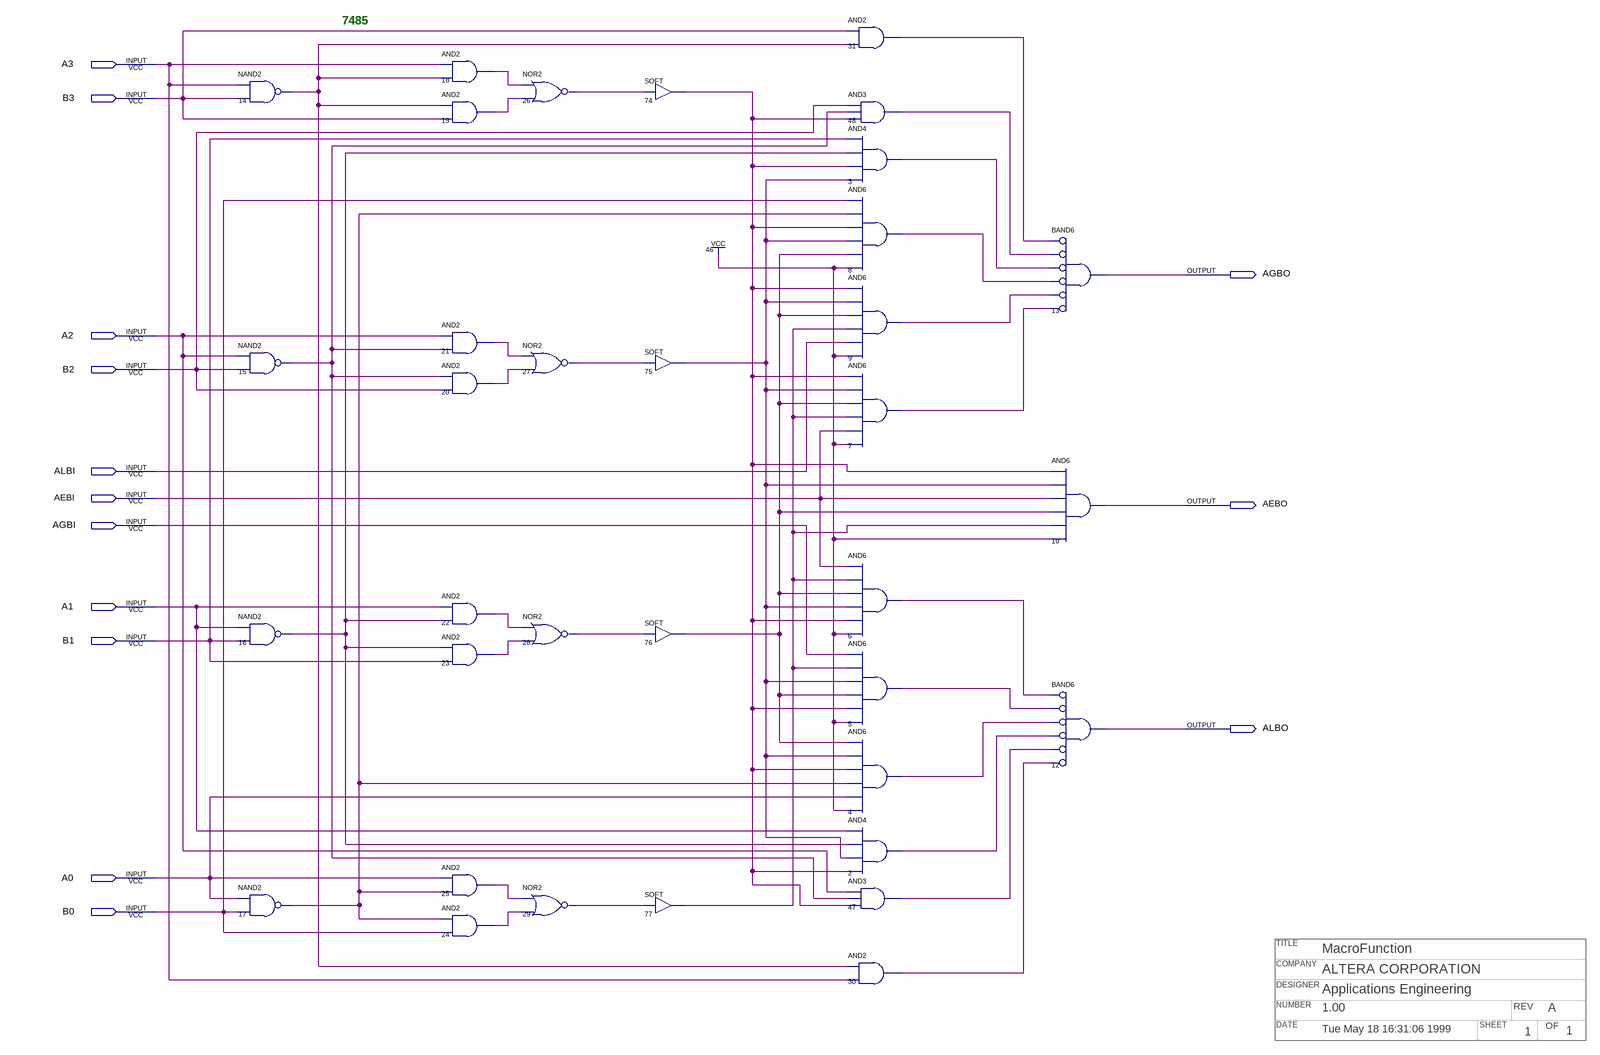
[diagram p0: schematic sheet]
// Quartus schematic p7485.bdf as structural Verilog: 35 symbols, 14 pins
// Title block: TITLE: MacroFunction; COMPANY: ALTERA CORPORATION; DESIGNER: Applications Engineering; NUMBER: 1.00; REV: A; DATE: Tue May 18 16:31:06 1999; SHEET: 1; OF: 1
module p7485 (
  input  A3,
  input  B3,
  input  A2,
  input  B2,
  input  ALBI,
  input  AEBI,
  input  AGBI,
  input  A1,
  input  B1,
  input  A0,
  input  B0,
  output AGBO,
  output AEBO,
  output ALBO
);

  wire n2_out, n3_out, n4_out, n5_out, n6_out, n7_out, n8_out, n9_out, n14_out, n15_out, n16_out, n17_out,
       n18_out, n19_out, n20_out, n21_out, n22_out, n23_out, n24_out, n25_out, n26_out, n27_out, n28_out,
       n29_out, n30_out, n31_out, n47_out, n48_out, n74_out, n75_out, n76_out, n77_out;

  nand u_14 (n14_out, A3, B3);
  nand u_15 (n15_out, A2, B2);
  nand u_16 (n16_out, A1, B1);
  nand u_17 (n17_out, A0, B0);
  and u_18 (n18_out, A3, n14_out);
  and u_19 (n19_out, n14_out, B3);
  and u_21 (n21_out, A2, n15_out);
  and u_20 (n20_out, n15_out, B2);
  and u_22 (n22_out, A1, n16_out);
  and u_23 (n23_out, n16_out, B1);
  and u_25 (n25_out, A0, n17_out);
  and u_24 (n24_out, n17_out, B0);
  nor u_26 (n26_out, n18_out, n19_out);
  nor u_27 (n27_out, n21_out, n20_out);
  nor u_28 (n28_out, n22_out, n23_out);
  nor u_29 (n29_out, n25_out, n24_out);
  SOFT u_74 (.IN(n26_out), .OUT(n74_out));
  SOFT u_75 (.IN(n27_out), .OUT(n75_out));
  SOFT u_76 (.IN(n28_out), .OUT(n76_out));
  SOFT u_77 (.IN(n29_out), .OUT(n77_out));
  and u_31 (n31_out, B3, n14_out);
  and u_48 (n48_out, B2, n15_out, n74_out);
  and u_3 (n3_out, B1, n16_out, n74_out, n75_out);
  and u_8 (n8_out, B0, n17_out, n74_out, n75_out, n76_out, 1'b1);
  and u_9 (n9_out, n74_out, n75_out, n76_out, n77_out, ALBI, 1'b1);
  and u_7 (n7_out, n74_out, n75_out, n76_out, n77_out, AEBI, 1'b1);
  and u_6 (n6_out, AEBI, n77_out, n76_out, n75_out, n74_out, 1'b1);
  and u_5 (n5_out, AGBI, n77_out, n75_out, n76_out, n74_out, 1'b1);
  and u_4 (n4_out, n76_out, n75_out, n74_out, n17_out, A0, 1'b1);
  and u_2 (n2_out, A1, n16_out, n75_out, n74_out);
  and u_47 (n47_out, A2, n15_out, n74_out);
  and u_30 (n30_out, n14_out, A3);
  and u_13 (AGBO, ~n31_out, ~n48_out, ~n3_out, ~n8_out, ~n9_out, ~n7_out);  // BAND6
  and u_10 (AEBO, n74_out, n75_out, AEBI, n76_out, n77_out, 1'b1);
  and u_12 (ALBO, ~n6_out, ~n5_out, ~n4_out, ~n2_out, ~n47_out, ~n30_out);  // BAND6

  // Notes on the sheet:
  //   7485
endmodule
